# Altium schematic sheet Cap 1uF 805.schdoc
size 127 x 101 mm
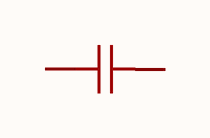
[diagram p0: Cap 1uF 805.schdoc]

## Parts
C?  1uF  [C0805]  (value not drawn)

## Nets

Not connected (* = marked no-connect by the designer): C? 1 2

## Library data of the parts
C? = GRM216R61E105KA12D: Manufacturer: muRata(村田); Add into BOM: yes; Tolerance: ±10%; Symbol: GRM216R61E105KA12D; Device: GRM216R61E105KA12D; LCSC Part Name: 1uF ±10% 25V; Supplier Part: C440193; Manufacturer Part: GRM216R61E105KA12D; Supplier Footprint: 0805; JLCPCB Part Class: Extended Part; Datasheet: https://atta.szlcsc.com/upload/public/pdf/source/20191022/C440211_D691AF4420B7318595498C3E4B7F2331.pdf; Supplier: LCSC; Convert to PCB: yes; Value: 1uF